# Altium schematic sheet IMU.SchDoc: IMU
size B; CheckedBy: Lance Bantoto; Engineer: Cindy Li; Organization: Altium Limited; Address1: L3, 12a Rodborough Rd; Address2: Frenchs Forest; Address3: NSW; Address4: Australia 2086; Revision: 1; SheetNumber: 4; SheetTotal: 6
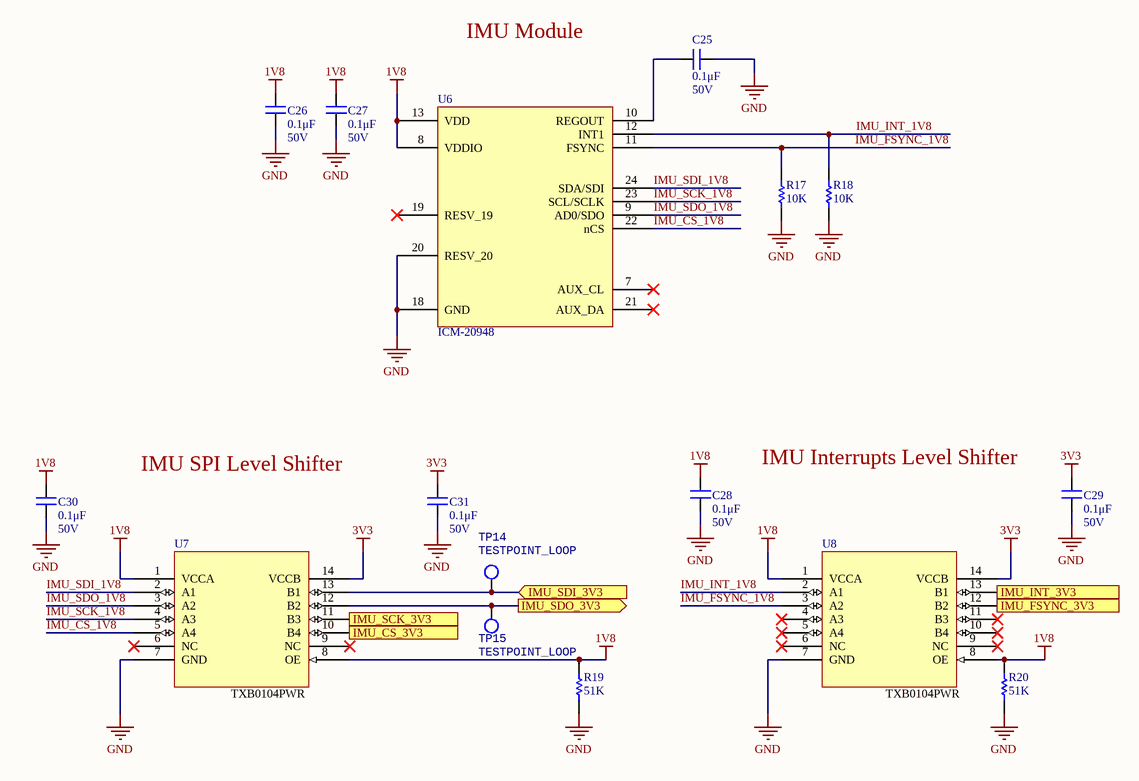
[diagram p0: IMU.SchDoc]

## Parts
C25  value 0.1μF  Voltage Rating: 50V  [CAP2012]  (hidden comment: CAP_0.1uF_50V_0805)
C26  value 0.1μF  Voltage Rating: 50V  [CAP2012]  (hidden comment: CAP_0.1uF_50V_0805)
C27  value 0.1μF  Voltage Rating: 50V  [CAP2012]  (hidden comment: CAP_0.1uF_50V_0805)
C28  value 0.1μF  Voltage Rating: 50V  [CAP2012]  (hidden comment: CAP_0.1uF_50V_0805)
C29  value 0.1μF  Voltage Rating: 50V  [CAP2012]  (hidden comment: CAP_0.1uF_50V_0805)
C30  value 0.1μF  Voltage Rating: 50V  [CAP2012]  (hidden comment: CAP_0.1uF_50V_0805)
C31  value 0.1μF  Voltage Rating: 50V  [CAP2012]  (hidden comment: CAP_0.1uF_50V_0805)
R17  value 10K  [RESC0603(1608)_N]  (hidden comment: RES_10K_0603)
R18  value 10K  [RESC0603(1608)_N]  (hidden comment: RES_10K_0603)
R19  value 51K  [RESC1608X55N]  (hidden comment: RES_51K_0603)
R20  value 51K  [RESC1608X55N]  (hidden comment: RES_51K_0603)
TP14  TESTPOINT_LOOP  [TESTPOINT_LOOP]
TP15  TESTPOINT_LOOP  [TESTPOINT_LOOP]
U6  IC_9DOF_IMU  [ICM-20948]  (value not drawn)
U7  TXB0104PWR  [PW14]
U8  TXB0104PWR  [PW14]

## Ports
IMU_CS_3V3 (in), IMU_FSYNC_3V3 (in), IMU_INT_3V3 (out), IMU_SCK_3V3 (in), IMU_SDI_3V3 (in), IMU_SDO_3V3 (out)

## Nets
1V8: C26.2 C27.2 C28.2 C30.2 R19.2 R20.2 U6.8(VDDIO) U6.13(VDD) U7.1(VCCA) U7.8(OE) U8.1(VCCA) U8.8(OE)
3V3: C29.2 C31.2 U7.14(VCCB) U8.14(VCCB)
GND: C25.2 C26.1 C27.1 C28.1 C29.1 C30.1 C31.1 R17.1 R18.1 R19.1 R20.1 U6.18(GND) U6.20(RESV_20) U7.7(GND) U8.7(GND)
IMU_CS_1V8: U6.22(nCS) U7.5(A4)
IMU_CS_3V3: U7.10(B4) ; port IMU_CS_3V3
IMU_FSYNC_1V8: R17.2 U6.11(FSYNC) U8.3(A2)
IMU_FSYNC_3V3: U8.12(B2) ; port IMU_FSYNC_3V3
IMU_INT_1V8: R18.2 U6.12(INT1) U8.2(A1)
IMU_INT_3V3: U8.13(B1) ; port IMU_INT_3V3
IMU_SCK_1V8: U6.23(SCL/SCLK) U7.4(A3)
IMU_SCK_3V3: U7.11(B3) ; port IMU_SCK_3V3
IMU_SDI_1V8: U6.24(SDA/SDI) U7.2(A1)
IMU_SDI_3V3: TP14.1 U7.13(B1) ; port IMU_SDI_3V3
IMU_SDO_1V8: U6.9(AD0/SDO) U7.3(A2)
IMU_SDO_3V3: TP15.1 U7.12(B2) ; port IMU_SDO_3V3
NetC25_1: C25.1 U6.10(REGOUT)

Not connected (* = marked no-connect by the designer): U6 7(AUX_CL)* 19(RESV_19)* 21(AUX_DA)*; U7 6(NC)* 9(NC)*; U8 4(A3)* 5(A4)* 6(NC)* 9(NC)* 10(B4)* 11(B3)*

## Notes on the sheet
- IMU Module
- IMU SPI Level Shifter
- (near C29) IMU Interrupts Level Shifter
- Title:
- Project:
- Date:
- Rev:
- Checker:
- Engineer:
- Sheet:
- of

## Library data of the parts
C25-C31 = CAP_0.1uF_50V_0805: CAP CER 0.1UF 50V X7R 0805; Manufacturer 1: Murata Electronics; Manufacturer Part Number 1: GCD21BR71H104KA01L; Tolerance: 10%; Mount: Surface Mount; Case Code (Metric): 2012; Case Code (Imperial): 0805; Min Operating Temperature: -55°C; Max Operating Temperature: 125°C; Dielectric: X7R; Termination: SMD/SMT; Length: 2mm; Height: 1.25mm; Width: 0.049inch; Thickness: 0.049inch; Depth: 1.25mm; Ratings: AEC-Q200; Supplier 1: Digi-Key; Supplier Part Number 1: 490-11955-1-ND; Package: 0805 (2012 Metric)
R17 R18 = RES_10K_0603: RES SMD 10K OHM 5% 1/10W 0603; Manufacturer 1: Yageo; Manufacturer Part Number 1: RC0603JR-0710KL; Package: 0603 (1608 Metric); Dimensions: 0.063" L x 0.031" W (1.60mm x 0.80mm); Tolerance: 5%; Supplier Part Number 1: 311-10KGRCT-ND; Supplier 1: Digi-Key; Mount: Surface Mount
R19 R20 = RES_51K_0603: RES SMD 51K OHM 5% 1/10W 0603; Manufacturer 1: Yageo; Manufacturer Part Number 1: RC0603JR-0751KL; Package: 0603 (1608 Metric); Dimensions: 0.063" L x 0.031" W (1.60mm x 0.80mm); Tolerance: 5%; Supplier Part Number 1: 311-51KGRCT-ND; Supplier 1: Digi-Key; Mount: Surface Mount
TP14 TP15 = TESTPOINT_LOOP: PC TEST POINT MINIATURE WHITE; Manufacturer Part Number 1: 5002; Manufacturer 1: Keystone Electronics; Supplier Part Number 1: 36-5002-ND; Supplier 1: Digi-Key; Mount: Through Hole
U6 = IC_9DOF_IMU: IMU ACCEL/GYRO/COMPI2C/SPI 24QFN; Manufacturer: TDK InvenSense; Sensor Type: Accelerometer,Gyroscope,Magnetometer; Output Type: SPI,I2C; Supplier 1: Digi-Key; Category: Inertial Measurement Units (IMUs); Mount: Surface Mount; Case/Package: QFN; Min Operating Temperature: -40°C; Max Operating Temperature: 85°C; Supplier Part Number 1: 1428-1123-1-ND; Manufacturer Part Number: ICM-20948
U7 U8 = IC_4CH_LVL_SHIFTER: 4-Bit Bidirectional Voltage-Level Translator with Auto Direction Sensing / VCCA < VCCB, see datasheet; Manufacturer 1: Texas Instruments; PACKAGE_DESIGNATOR: PW; PIN_COUNT: 14; FAMILY_NAME: AUTO DIRECTION SENSING DUAL SUPPLY TRANSLATOR; INDUSTRY_STD_PKG_TYPE: TSSOP; VCCB MAX: 5.5 V; VCCA MAX: 3.6 V; GENERIC_PART_NUMBER: TXB0104; Datasheet_URL: http://www.ti.com/lit/gpn/TXB0104; Supplier 1: Digi-Key; Supplier Part Number 1: 296-21929-1-ND; Manufacturer Part Number 1: TXB0104PWR